# Altium schematic sheet [5]-COM.SchDoc
size A
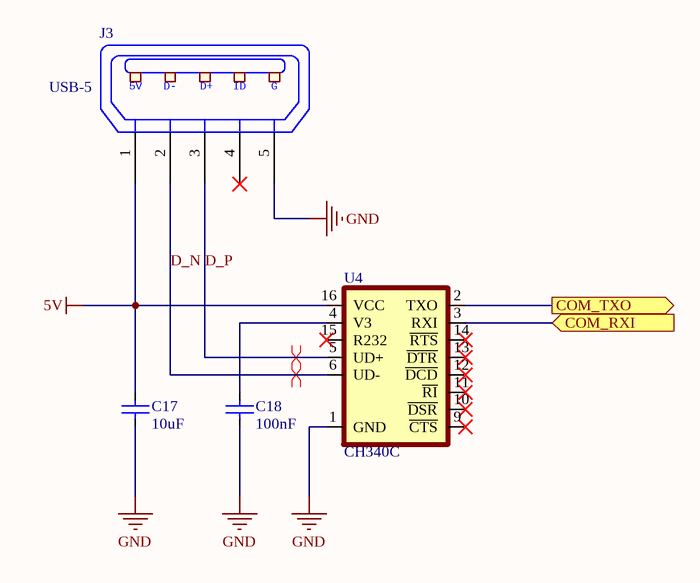
[diagram p0: [5]-COM.SchDoc]

## Parts
C17  10uF  [CAP_0805]
C18  100nF  [CAP_0805]
J3  USB-5  [USB-M1]
U4  CH340C  [SO16]

## Ports
COM_RXI (in), COM_TXO (out)

## Nets
5V: C17.2 J3.1(P1) U4.16(VCC)
GND: C17.1 C18.1 J3.5(P5) U4.1(GND)
COM_RXI: U4.3(RXI) ; port COM_RXI
COM_TXO: U4.2(TXO) ; port COM_TXO
D_N: J3.2(P2) U4.6(UD-)
D_P: J3.3(P3) U4.5(UD+)
NetC18_2: C18.2 U4.4(V3)

Not connected (* = marked no-connect by the designer): J3 4(P4)*; U4 9(~{CTS})* 10(~{DSR})* 11(~{RI})* 12(~{DCD})* 13(~{DTR})* 14(~{RTS})* 15(R232)*

## Layout directives
differential pair: D_N, D_P

## Notes on the sheet
- (in symbol USB-5) 5V; D-; D+; ID; G

## Library data of the parts
C17 C18 = CapSMD: Capacitor; Value: 33p; Published: 8-Jun-2000; LatestRevisionDate: 17-Jul-2002; LatestRevisionNote: Re-released for DXP Platform.; PackageReference: RAD-0.3; Publisher: Altium Limited
J3 = USB-5: Manufacturer: FCI; Manufacturer Part Number: 10118193-0001LF; Connector Type: USB - micro B; Number of Contacts: 5; Gender: Receptacle; Specifications: USB 2.0; .Creator: MM; .Checked PCB: RF; Supplier 1: Digi-Key; RoHS: RoHS Compliant; Category: Connectors, Interconnects; Stock 1: 28642; Pricing 1: 1=0.46, 10=0.433, 25=0.3712, 50=0.3156, 100=0.3032, 250=0.27224, 500=0.25988 (USD); Packaging: Cut Tape (CT); Mounting Type: Surface Mount, Right Angle, Horizontal; Features: Shielded, Solder Retention; Ingress Protection: -; ComponentLink1URL: http://portal.fciconnect.com/Comergent//fci/drawing/10118193.pdf; ComponentLink1Description: http://portal.fciconnect.com/Comergent//fci/drawing/10118193.pdf; Supplier Part Number 1: 609-4616-1-ND; .Checked SCH: MM
U4 = CH340C: USB to serial chip CH340; MF: WCH; Package: Package; Check_prices: https://www.snapeda.com/parts/CH340C/WCH/view-part/5428851/?ref=eda; Value: *; Price: None; MP: CH340C; Availability: Unavailable; SnapEDA_Link: https://www.snapeda.com/parts/CH340C/WCH/view-part/5428851/?ref=snap